# Altium schematic sheet LineFollower2.SchDoc
size 381 x 381 mm; SheetNumber: 1; SheetTotal: 1
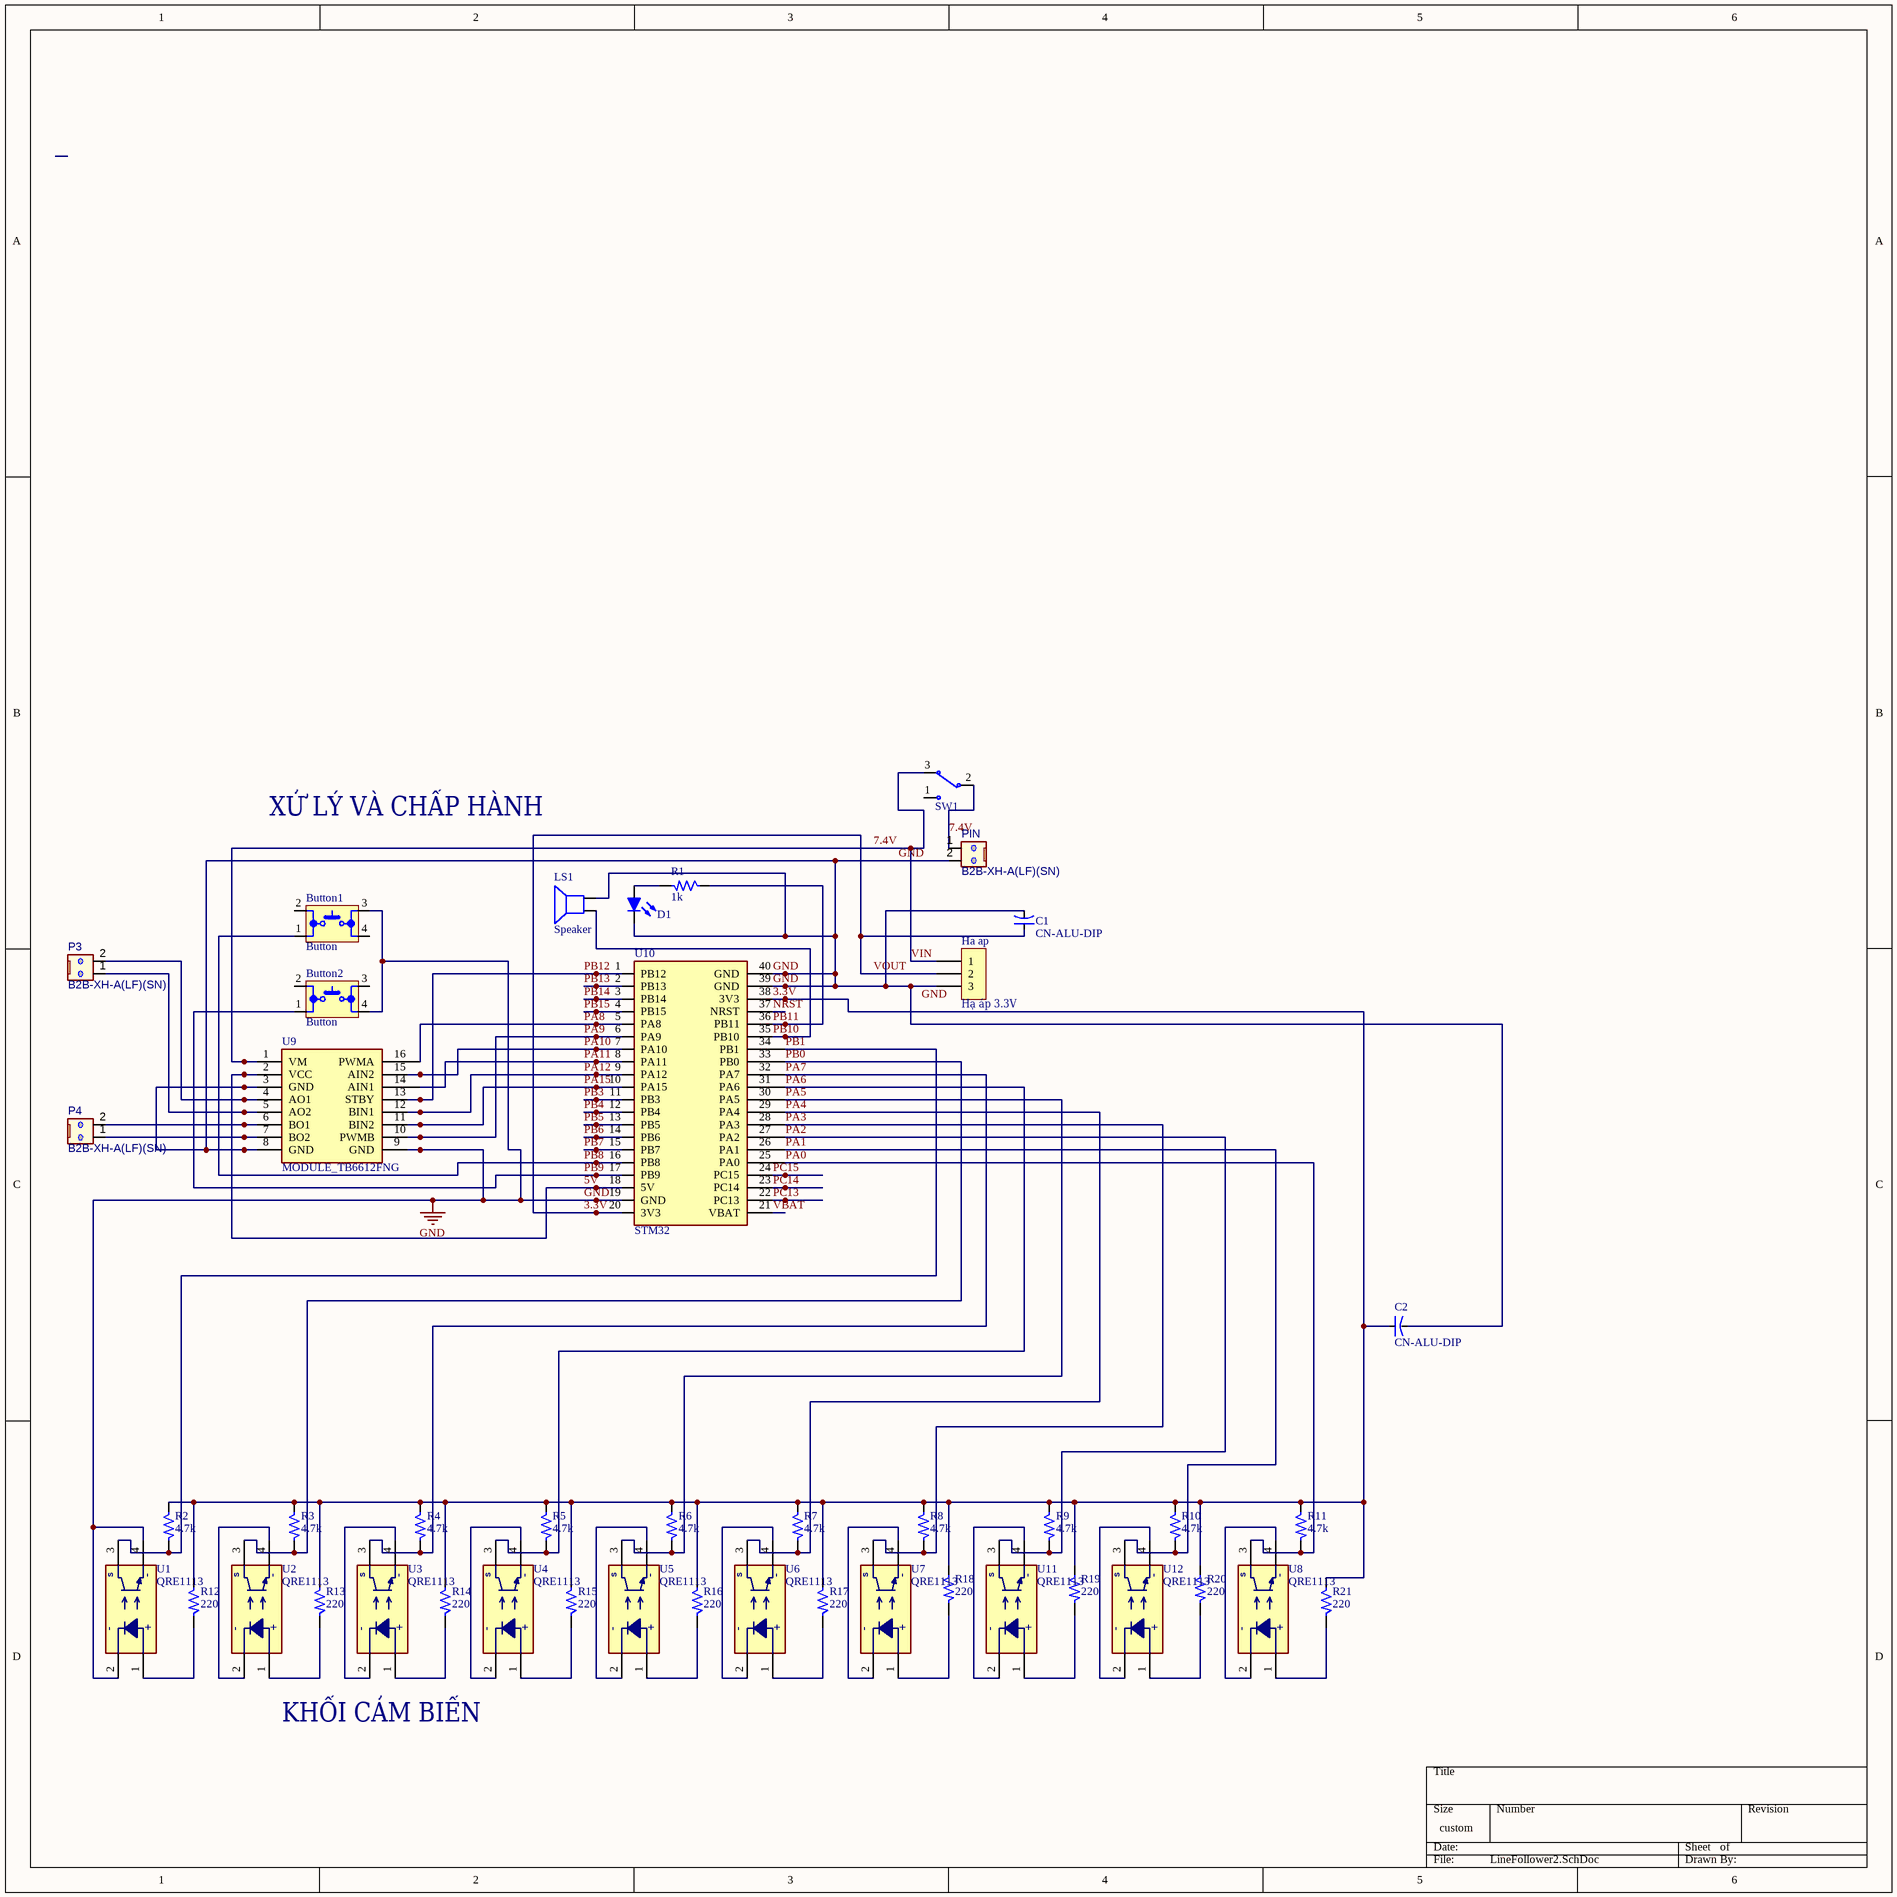
[diagram p0: LineFollower2.SchDoc]

## Parts
Button1  Button  [1825910-6_BUTTON]
Button2  Button  [1825910-6_BUTTON]
C1  CN-ALU-DIP  [CA-ALU-2.54]
C2  CN-ALU-DIP  [CA-ALU-2.54]
D1  Led  [LED 5MM - RED]  (value not drawn)
Ha_ap  Hạ áp 3.3V  [CON3]
LS1  Speaker  [SPEAKER]
P3  B2B-XH-A(LF)(SN)  [JST-B2B-XH-A_V]
P4  B2B-XH-A(LF)(SN)  [JST-B2B-XH-A_V]
PIN  B2B-XH-A(LF)(SN)  [JST-B2B-XH-A_V]
R1  1k  [R1/4W]
R2  4.7k  [R1/4W]
R3  4.7k  [R1/4W]
R4  4.7k  [R1/4W]
R5  4.7k  [R1/4W]
R6  4.7k  [R1/4W]
R7  4.7k  [R1/4W]
R8  4.7k  [R1/4W]
R9  4.7k  [R1/4W]
R10  4.7k  [R1/4W]
R11  4.7k  [R1/4W]
R12  220  [R1/4W]
R13  220  [R1/4W]
R14  220  [R1/4W]
R15  220  [R1/4W]
R16  220  [R1/4W]
R17  220  [R1/4W]
R18  220  [R1/4W]
R19  220  [R1/4W]
R20  220  [R1/4W]
R21  220  [R1/4W]
SW1  EG1218  [EG1218]  (value not drawn)
U1  QRE1113  [QRE1113]
U2  QRE1113  [QRE1113]
U3  QRE1113  [QRE1113]
U4  QRE1113  [QRE1113]
U5  QRE1113  [QRE1113]
U6  QRE1113  [QRE1113]
U7  QRE1113  [QRE1113]
U8  QRE1113  [QRE1113]
U9  MODULE_TB6612FNG  [MODULE_TB6612FNG]
U10  STM32  [STM32]
U11  QRE1113  [QRE1113]
U12  QRE1113  [QRE1113]

## Nets
GND: Button1.3 Button2.4 C1.2 C2.2 D1.2(K) Ha_ap.3 LS1.2 PIN.2 U1.2(GND) U1.4(GND) U9.3(GND) U9.8(GND) U9.9(GND) U10.19(GND) U10.39(GND) U10.40(GND)
3.3V: C1.1 C2.1 Ha_ap.2 R2.1 R3.1 R4.1 R5.1 R6.1 R7.1 R8.1 R9.1 R10.1 R11.1 R12.1 R13.1 R14.1 R15.1 R16.1 R17.1 R18.1 R19.1 R20.1 R21.1 U10.20(3V3) U10.38(3V3)  [also labelled VOUT]
5V: U9.2(VCC) U10.18(5V)
7.4V: Ha_ap.1 PIN.1 SW1.2 SW1.3 U9.1(VM)  [also labelled VIN]
NRST: U10.37(NRST)
PA0: R11.2 U8.3(SIGNAL) U10.25(PA0)
PA1: R10.2 U10.26(PA1) U12.3(SIGNAL)
PA2: R9.2 U10.27(PA2) U11.3(SIGNAL)
PA3: R8.2 U7.3(SIGNAL) U10.28(PA3)
PA4: R7.2 U6.3(SIGNAL) U10.29(PA4)
PA5: R6.2 U5.3(SIGNAL) U10.30(PA5)
PA6: R5.2 U4.3(SIGNAL) U10.31(PA6)
PA7: R4.2 U3.3(SIGNAL) U10.32(PA7)
PA8: U9.16(PWMA) U10.5(PA8)
PA9: U9.10(PWMB) U10.6(PA9)
PA10: U9.15(AIN2) U10.7(PA10)
PA11: U9.14(AIN1) U10.8(PA11)
PA12: U9.12(BIN1) U10.9(PA12)
PA15: U9.11(BIN2) U10.10(PA15)
PB0: R3.2 U2.3(SIGNAL) U10.33(PB0)
PB1: R2.2 U1.3(SIGNAL) U10.34(PB1)
PB3: U10.11(PB3)
PB4: U10.12(PB4)
PB5: U10.13(PB5)
PB6: U10.14(PB6)
PB7: U10.15(PB7)
PB8: Button1.1 U10.16(PB8)
PB9: Button2.1 U10.17(PB9)
PB10: LS1.1 U10.35(PB10)
PB11: R1.1 U10.36(PB11)
PB12: U9.13(STBY) U10.1(PB12)
PB13: U10.2(PB13)
PB14: U10.3(PB14)
PB15: U10.4(PB15)
PC13: U10.22(PC13)
PC14: U10.23(PC14)
PC15: U10.24(PC15)
VBAT: U10.21(VBAT)
NetD1_1: D1.1(A) R1.2
NetP3_1: P3.1 U9.5(AO2)
NetP3_2: P3.2 U9.4(AO1)
NetP4_1: P4.1 U9.7(BO2)
NetP4_2: P4.2 U9.6(BO1)
NetR12_2: R12.2 U1.1(VCC)
NetR13_2: R13.2 U2.1(VCC)
NetR14_2: R14.2 U3.1(VCC)
NetR15_2: R15.2 U4.1(VCC)
NetR16_2: R16.2 U5.1(VCC)
NetR17_2: R17.2 U6.1(VCC)
NetR18_2: R18.2 U7.1(VCC)
NetR19_2: R19.2 U11.1(VCC)
NetR20_2: R20.2 U12.1(VCC)
NetR21_2: R21.2 U8.1(VCC)
NetU2_2: U2.2(GND) U2.4(GND)
NetU3_2: U3.2(GND) U3.4(GND)
NetU4_2: U4.2(GND) U4.4(GND)
NetU5_2: U5.2(GND) U5.4(GND)
NetU6_2: U6.2(GND) U6.4(GND)
NetU7_2: U7.2(GND) U7.4(GND)
NetU8_2: U8.2(GND) U8.4(GND)
NetU11_2: U11.2(GND) U11.4(GND)
NetU12_2: U12.2(GND) U12.4(GND)

Not connected (* = marked no-connect by the designer): Button1 2 4; Button2 2 3; SW1 1

## Notes on the sheet
- XỬ LÝ VÀ CHẤP HÀNH
- KHỐI CẢM BIẾN
- Labels drawn without touching a wire or pin: GND
- (in symbol QRE1113) S; -; +

## Library data of the parts
Button1 Button2 = 1825910-6: SWITCH TACTILE SPST-NO 0.05A 24V; Manufacturer: TE Connectivity Alcoswitch; Actuator Material: PBT; Mechanical Life: 100000Cycles; Operating Force: 160gf; Throw Configuration: SPST; Illumination Type: Non-Illuminated,Illuminated; Switch Travel: 0.25mm; Switch Function: Off-Mom; Contact Current Rating: 50mA; Actuator Type: Standard; Contact Resistance: 100mR; Actuator Length: 0.055inch; Manufacturer Part Number: 1825910-6; RoHS: Yes; Category: Pushbutton Switches; Stock 1: 97530; Pricing 1: 1=0,10000, 10=0,10100, 25=0,09560, 100=0,08700, 250=0,08180, 500=0,07484, 1000=0,06265, 2500=0,06092, 5000=0,05743 (USD); Mount: Through Hole; Contact Material: Copper Alloy; Contact Plating: Silver; Min Operating Temperature: -35°C; Max Operating Temperature: 85°C; Termination: PC Pins; Package Quantity: 750; Packaging: Loose Piece; Orientation: Straight; Max Voltage Rating (DC): 24V; Electrical Life: 100000Cycles; Max Current Rating: 50mA; Type: Switch; Length: 5.99mm; REACH SVHC: Unknown; ELV: Compliant; Lead Free: Lead Free; ComponentLink1URL: https://datasheet.ciiva.com/30199/1825910-6rqpn1825910-6-30199520.pdf?src-supplier=Onlinecomponents.com; ComponentLink1Description: https://datasheet.ciiva.com/30199/1825910-6rqpn1825910-6-30199520.pdf?src-supplier=Onlinecomponents.com; ComponentLink2URL: https://datasheet.ciiva.com/15184/getdatasheetpartid-395915-15184509.pdf?src-supplier=Verical; ComponentLink2Description: https://datasheet.ciiva.com/15184/getdatasheetpartid-395915-15184509.pdf?src-supplier=Verical; Supplier 1: Digi-Key; Supplier Part Number 1: 450-1650-ND
C1 C2 = CN-ALU-DIP: Capacitor (Semiconductor SIM Model); Value: 104; LatestRevisionDate: 17-Jul-2002; LatestRevisionNote: Re-released for DXP Platform.; PackageReference: C1206; Publisher: Altium Limited
D1 = Led: Typical LED
Ha_ap = CON3: Connector
LS1 = Speaker: Loudspeaker; Published: 24-Mar-1999; LatestRevisionDate: 17-Jul-2002; LatestRevisionNote: Re-released for DXP Platform.; PackageReference: PIN2; Publisher: Altium Limited
P3 P4 PIN = HEADER_2P_2.5MM: CONN HEADER VERT 2POS 2.5MM; Manufacturer 1: JST Sales America Inc.; Max Voltage Rating (AC): 250V; Contact Resistance: 20mR; Current Rating: 3A; Number of Contacts: 2; Connector Type: Male Pin; Wire/Cable Gauge: 22AWG; Pitch: 2.5mm; Contact Material: Brass; Manufacturer Part Number 1: B2B-XH-A(LF)(SN); Orientation: Straight; Number of Rows: 1; Mount: Through Hole; Voltage Rating: 250V; Lead Pitch: 2.5mm; Length: 7.4mm; Number of Positions: 2; Min Operating Temperature: -25°C; Housing Material: Polyamide; Housing Color: White; Voltage Rating (AC): 250V; Depth: 5.75mm; Max Voltage Rating (DC): 250V; Contact Plating: Tin,Copper,Lead; Color: Natural; Max Current Rating: 3A
R1-R21 = Res: Resistor 1/4W; Value: R1/4W - 1K
SW1 = SW_SPDT: SWITCH SLIDE SPDT 200MA 30V; Manufacturer: E-Switch; Manufacturer Part Number 1: EG1218
U1-U8 U11 U12 = QRE1113: REFLECTIVE OPTICAL SENSOR SMD; Digikey PN: 512-QRE1113GR; ComponentLink1Description: Datasheet; ComponentLink1URL: https://br.mouser.com/datasheet/2/308/QRE1113_D-1814544.pdf; JLCPCB PN: C232862
U9 = MODULE_TB6612FNG: Module Dual Motor Driver 2.5-13.5V 3.2A Peak 21x18mm; ComponentLink1Description: Datasheet; ComponentLink1URL: https://www.mouser.com/datasheet/2/408/TB6612FNG_datasheet_en_20141001-708260.pdf